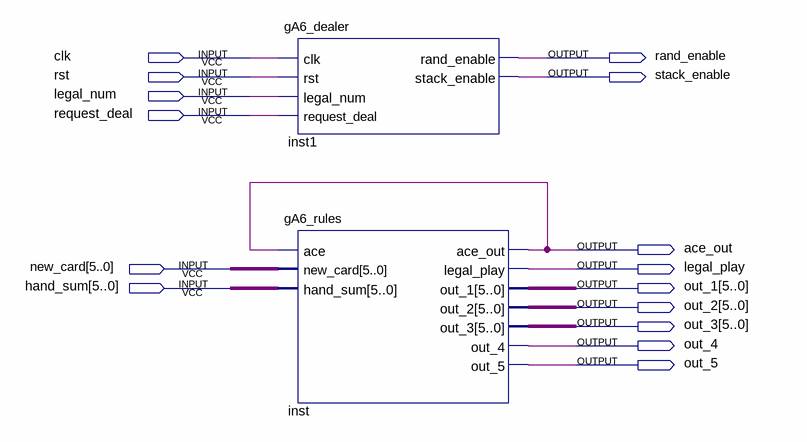
[diagram p0: schematic sheet]
// Quartus schematic gA6_rules_dealer.bdf as structural Verilog: 2 symbols, 15 pins
module gA6_rules_dealer (
  input  clk,
  input  rst,
  input  legal_num,
  input  request_deal,
  input  [5:0] new_card,
  input  [5:0] hand_sum,
  output rand_enable,
  output stack_enable,
  output ace_out,
  output legal_play,
  output [5:0] out_1,
  output [5:0] out_2,
  output [5:0] out_3,
  output out_4,
  output out_5
);

  gA6_dealer inst1 (
    .clk(clk), .rst(rst), .legal_num(legal_num), .request_deal(request_deal), .rand_enable(rand_enable),
    .stack_enable(stack_enable));
  gA6_rules inst (
    .ace(ace_out), .new_card(new_card), .hand_sum(hand_sum), .ace_out(ace_out), .legal_play(legal_play),
    .out_1(out_1), .out_2(out_2), .out_3(out_3), .out_4(out_4), .out_5(out_5));
endmodule
